# Altium project Power Controller V2.0.PrjPcb
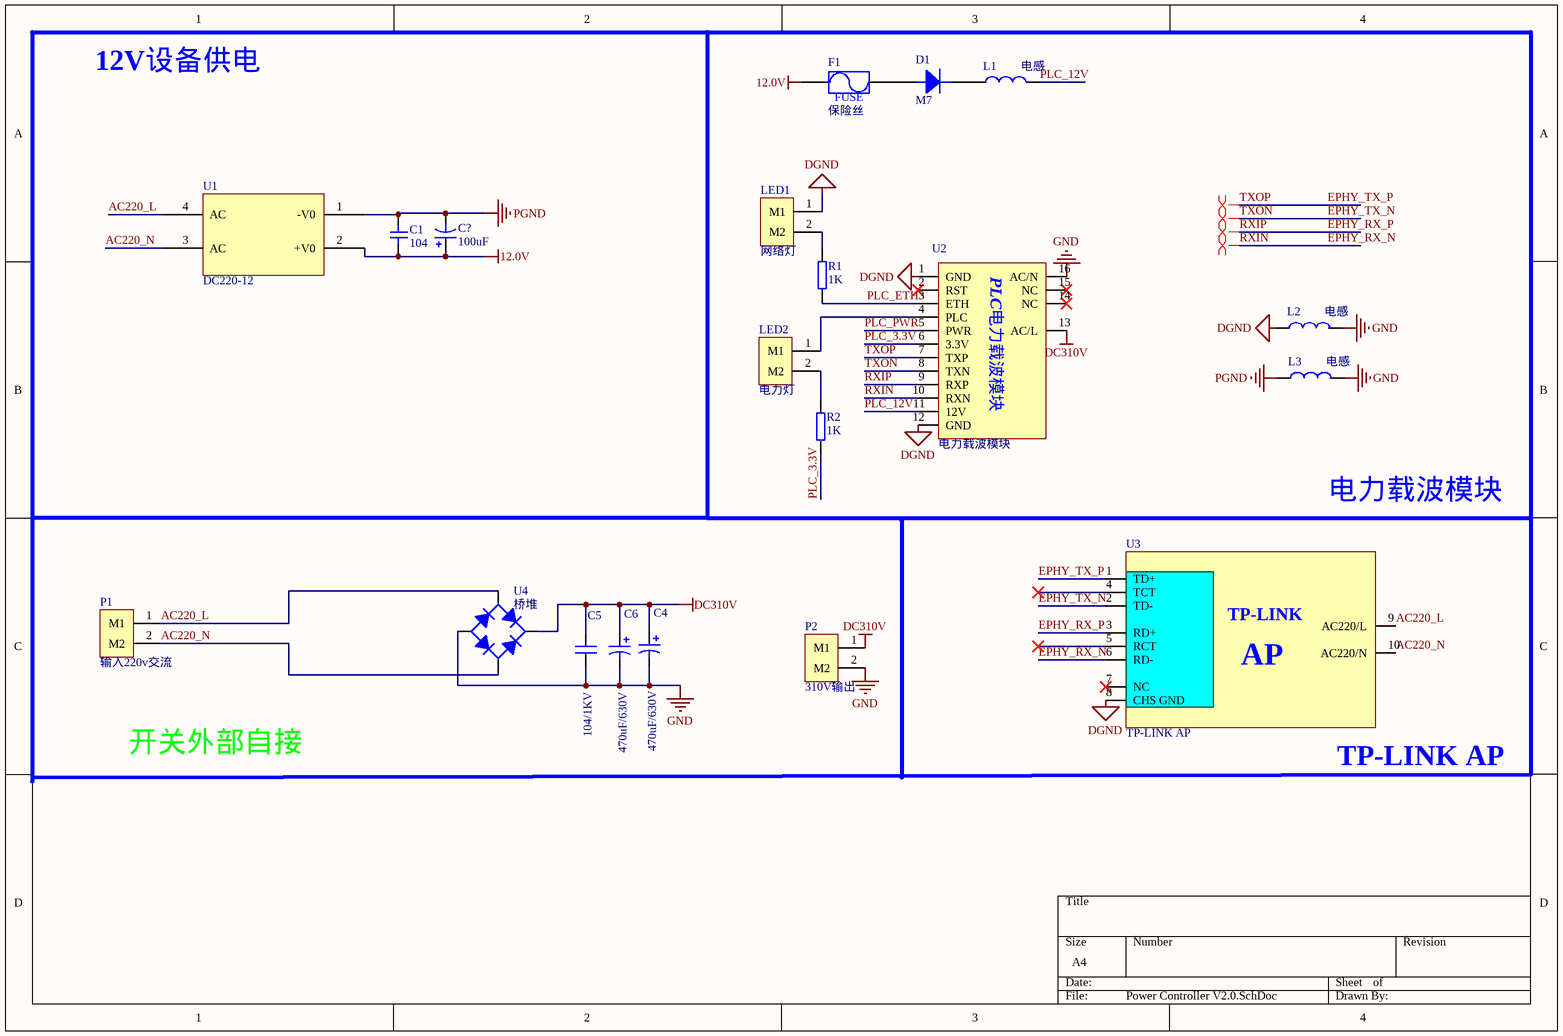
[diagram p0: Power Controller V2.0.SchDoc]
1 sheet, 20 parts. Net scope: global (net labels, ports and power ports of the same name join across sheets).
Board file: Power Controller V2.0.PcbDoc

## Sheet Power Controller V2.0.SchDoc
size A4

### Parts
C1  104  [0805C]
C4  470uF/630V  [RB.3.6]
C5  104/1KV  [无极性直插电容]
C6  470uF/630V  [RB.2.4]
C?  100uF  [TAJ-B]
D1  M7  [SMA/DO-214AC]
F1  保险丝  [FUSE-1206]
L1  电感  [1206L]
L2  电感  [1206L]
L3  电感  [1206L]
LED1  网络灯  [LED-RED直插)]
LED2  电力灯  [LED-BLUE(直插)]
P1  输入220v交流  [XT60-F]
P2  310V输出  [XT60-F]
R1  1K  [0805R]
R2  1K  [0805R]
U1  DC220-12  [AC220-DC5/12]
U2  电力载波模块  [电力载波模块]
U3  TP-LINK AP  [TP-Link路由器盒封装]
U4  桥堆  [整流全桥]

### Nets
12.0V: C1.1 C?.1 F1.1 U1.2(+V0)
DC310V: C4.1 C5.2 C6.1 P2.1(M1) U2.13(AC/L) U4.DC+
DGND: L2.1 LED1.1(M1) U2.1(GND) U2.12(GND) U3.8(CHS_GND)
GND: C4.2 C5.1 C6.2 L2.2 L3.2 P2.2(M2) U2.16(AC/N) U4.DC-
PGND: C1.2 C?.2 L3.1 U1.1(-V0)
AC220_L: P1.1(M1) U1.4(AC) U3.9(AC220/L) U4.AC1
AC220_N: P1.2(M2) U1.3(AC) U3.10(AC220/N) U4.AC2
EPHY_RX_N: U2.10(RXN) U3.6(RD-)  [also labelled RXIN]
EPHY_RX_P: U2.9(RXP) U3.3(RD+)  [also labelled RXIP]
EPHY_TX_N: U2.8(TXN) U3.2(TD-)  [also labelled TXON]
EPHY_TX_P: U2.7(TXP) U3.1(TD+)  [also labelled TXOP]
PLC_3.3V: R2.1 U2.6(3.3V)
PLC_12V: L1.2 U2.11(12V)
PLC_ETH: R1.2 U2.3(ETH)
PLC_PWR: U2.5(PWR)
NetD1_1: D1.1 F1.2
NetD1_2: D1.2 L1.1
NetLED1_2: LED1.2(M2) R1.1
NetLED2_1: LED2.1(M1) U2.4(PLC)
NetLED2_2: LED2.2(M2) R2.2

Not connected (* = marked no-connect by the designer): U2 2(RST)* 14(NC)* 15(NC)*; U3 4(TCT)* 5(RCT)* 7(NC)*

### Layout directives
differential pair: EPHY_RX_N, EPHY_RX_P, EPHY_TX_N, EPHY_TX_P

### Notes on the sheet
- 12V设备供电
- 电力载波模块
- 开关外部自接
- (near U3) TP-LINK AP
- (in symbol Fuse) FUSE
- (in symbol TP-LINK封装) TP-LINK; AP
- (in symbol 电力载波模块6410) PLC电力载波模块

### Library data of the parts
C1 = Cap1: 无极贴片电容
C4 C6 = Cap3: 直插极性电容
C5 = Cap2: 无极直插电容
C? = Pol Cap: 极性贴片电容
D1 = Diode: 二极管
F1 = Fuse
L1-L3 = L
LED1 LED2 P1 P2 = 接线端子-2PIN: 2PIN
R1 R2 = Res: 电阻
U1 = DC220-24
U2 = 电力载波模块6410
U3 = TP-LINK封装